# Altium schematic sheet ADC_1.SchDoc
size A4
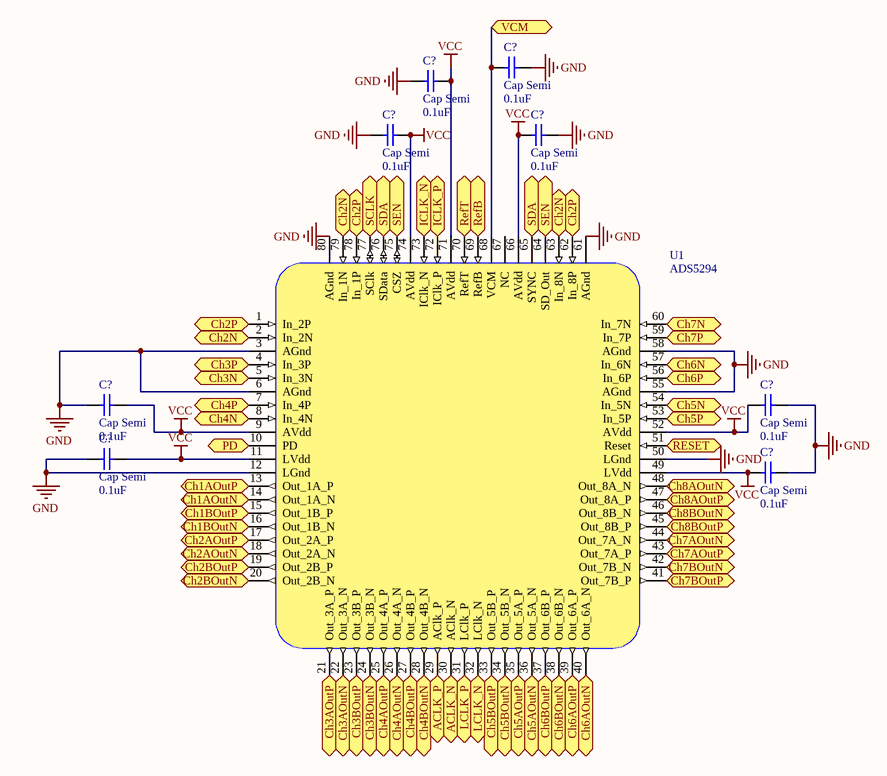
[diagram p0: ADC_1.SchDoc]

## Parts
(Parts that share a designator on the sheet are numbered #1, #2 ... from top to bottom, then left to right.)
C?#1  Cap Semi  value 0.1uF  [1608[0603]]
C?#2  Cap Semi  value 0.1uF  [1608[0603]]
C?#3  Cap Semi  value 0.1uF  [1608[0603]]
C?#4  Cap Semi  value 0.1uF  [1608[0603]]
C?#5  Cap Semi  value 0.1uF  [1608[0603]]
C?#6  Cap Semi  value 0.1uF  [1608[0603]]
C?#7  Cap Semi  value 0.1uF  [1608[0603]]
C?#8  Cap Semi  value 0.1uF  [1608[0603]]
U1  ADS5294  [PFP80_M]

## Ports
ACLK_N, ACLK_P, Ch1AOutN, Ch1AOutP, Ch1BOutN, Ch1BOutP, Ch2AOutN, Ch2AOutP, Ch2BOutN, Ch2BOutP, Ch2N, Ch2P, Ch3AOutN, Ch3AOutP, Ch3BOutN, Ch3BOutP, Ch3N, Ch3P, Ch4AOutN, Ch4AOutP, Ch4BOutN, Ch4BOutP, Ch4N, Ch4P, Ch5AOutN, Ch5AOutP, Ch5BOutN, Ch5BOutP, Ch5N, Ch5P, Ch6AOutN, Ch6AOutP, Ch6BOutN, Ch6BOutP, Ch6N, Ch6P, Ch7AOutN, Ch7AOutP, Ch7BOutN, Ch7BOutP, Ch7N, Ch7P, Ch8AOutN, Ch8AOutP, Ch8BOutN, Ch8BOutP, ICLK_N, ICLK_P, LCLK_N, LCLK_P, PD, RefB, RefT, RESET, SCLK, SDA, SEN, VCM

## Nets
GND: C?#1.2 C?#2.2 C?#3.1 C?#4.2 C?#5.1 C?#6.2 C?#7.1 C?#8.2 U1.3(AGnd) U1.6(AGnd) U1.12(LGnd) U1.50(LGnd) U1.55(AGnd) U1.58(AGnd) U1.61(AGnd) U1.80(AGnd)
VCC: C?#2.1 C?#3.2 C?#4.1 C?#5.2 C?#6.1 C?#7.2 C?#8.1 U1.9(AVdd) U1.11(LVdd) U1.49(LVdd) U1.52(AVdd) U1.66(AVdd) U1.71(AVdd) U1.74(AVdd)
ACLK_N: U1.30(AClk_N) ; port ACLK_N
ACLK_P: U1.29(AClk_P) ; port ACLK_P
Ch1AOutN: U1.14(Out_1A_N) ; port Ch1AOutN
Ch1AOutP: U1.13(Out_1A_P) ; port Ch1AOutP
Ch1BOutN: U1.16(Out_1B_N) ; port Ch1BOutN
Ch1BOutP: U1.15(Out_1B_P) ; port Ch1BOutP
Ch2AOutN: U1.18(Out_2A_N) ; port Ch2AOutN
Ch2AOutP: U1.17(Out_2A_P) ; port Ch2AOutP
Ch2BOutN: U1.20(Out_2B_N) ; port Ch2BOutN
Ch2BOutP: U1.19(Out_2B_P) ; port Ch2BOutP
Ch2N: U1.2(In_2N) U1.63(In_8N) U1.79(In_1N) ; port Ch2N
Ch2P: U1.1(In_2P) U1.62(In_8P) U1.78(In_1P) ; port Ch2P
Ch3AOutN: U1.22(Out_3A_N) ; port Ch3AOutN
Ch3AOutP: U1.21(Out_3A_P) ; port Ch3AOutP
Ch3BOutN: U1.24(Out_3B_N) ; port Ch3BOutN
Ch3BOutP: U1.23(Out_3B_P) ; port Ch3BOutP
Ch3N: U1.5(In_3N) ; port Ch3N
Ch3P: U1.4(In_3P) ; port Ch3P
Ch4AOutN: U1.26(Out_4A_N) ; port Ch4AOutN
Ch4AOutP: U1.25(Out_4A_P) ; port Ch4AOutP
Ch4BOutN: U1.28(Out_4B_N) ; port Ch4BOutN
Ch4BOutP: U1.27(Out_4B_P) ; port Ch4BOutP
Ch4N: U1.8(In_4N) ; port Ch4N
Ch4P: U1.7(In_4P) ; port Ch4P
Ch5AOutN: U1.36(Out_5A_N) ; port Ch5AOutN
Ch5AOutP: U1.35(Out_5A_P) ; port Ch5AOutP
Ch5BOutN: U1.34(Out_5B_N) ; port Ch5BOutN
Ch5BOutP: U1.33(Out_5B_P) ; port Ch5BOutP
Ch5N: U1.54(In_5N) ; port Ch5N
Ch5P: U1.53(In_5P) ; port Ch5P
Ch6AOutN: U1.40(Out_6A_N) ; port Ch6AOutN
Ch6AOutP: U1.39(Out_6A_P) ; port Ch6AOutP
Ch6BOutN: U1.38(Out_6B_N) ; port Ch6BOutN
Ch6BOutP: U1.37(Out_6B_P) ; port Ch6BOutP
Ch6N: U1.57(In_6N) ; port Ch6N
Ch6P: U1.56(In_6P) ; port Ch6P
Ch7AOutN: U1.44(Out_7A_N) ; port Ch7AOutN
Ch7AOutP: U1.43(Out_7A_P) ; port Ch7AOutP
Ch7BOutN: U1.42(Out_7B_N) ; port Ch7BOutN
Ch7BOutP: U1.41(Out_7B_P) ; port Ch7BOutP
Ch7N: U1.60(In_7N) ; port Ch7N
Ch7P: U1.59(In_7P) ; port Ch7P
Ch8AOutN: U1.48(Out_8A_N) ; port Ch8AOutN
Ch8AOutP: U1.47(Out_8A_P) ; port Ch8AOutP
Ch8BOutN: U1.46(Out_8B_N) ; port Ch8BOutN
Ch8BOutP: U1.45(Out_8B_P) ; port Ch8BOutP
ICLK_N: U1.73(IClk_N) ; port ICLK_N
ICLK_P: U1.72(IClk_P) ; port ICLK_P
LCLK_N: U1.32(LClk_N) ; port LCLK_N
LCLK_P: U1.31(LClk_P) ; port LCLK_P
PD: U1.10(PD) ; port PD
RefB: U1.69(RefB) ; port RefB
RefT: U1.70(RefT) ; port RefT
RESET: U1.51(Reset) ; port RESET
SCLK: U1.77(SClk) ; port SCLK
SDA: U1.65(SYNC) U1.76(SData) ; port SDA
SEN: U1.64(SD_Out) U1.75(CSZ) ; port SEN
VCM: C?#1.1 U1.68(VCM) ; port VCM

Not connected (* = marked no-connect by the designer): U1 67(NC)

## Library data of the parts
C?#1-C?#8 = Cap Semi: Capacitor (Semiconductor SIM Model); Published: 8-Jun-2000; LatestRevisionDate: 29-May-2009; LatestRevisionNote: IPC-7351 Footprint Added.; PackageReference: C1206; Publisher: Altium Limited; PackageDescription: Chip Capacitor